# Altium schematic sheet Bandpass.SchDoc
size A; SheetNumber: 4; SheetTotal: 7
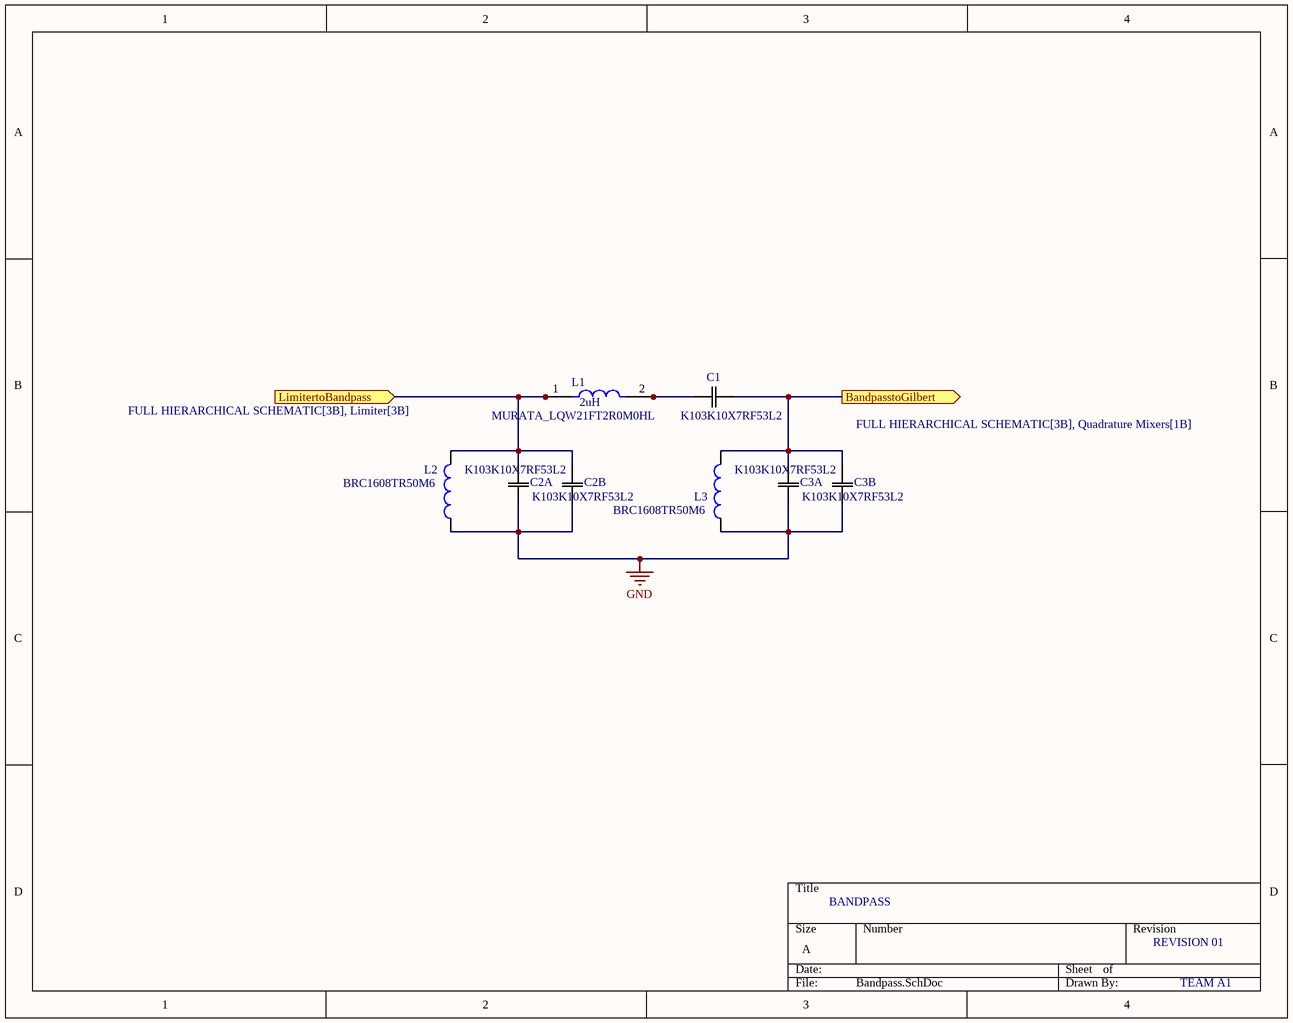
[diagram p0: Bandpass.SchDoc]

## Parts
C1  K103K10X7RF53L2  [K103K10X7RF53L2_VIS]
C2A  K103K10X7RF53L2  [K103K10X7RF53L2_VIS]
C2B  K103K10X7RF53L2  [K103K10X7RF53L2_VIS]
C3A  K103K10X7RF53L2  [K103K10X7RF53L2_VIS]
C3B  K103K10X7RF53L2  [K103K10X7RF53L2_VIS]
L1  MURATA_LQW21FT2R0M0HL  [MURATA_LQW21FT2R0M0HL_0]
L2  BRC1608TR50M6  [INDC1608X100N]
L3  BRC1608TR50M6  [INDC1608X100N]

## Ports
BandpasstoGilbert (out, see FULL HIERARCHICAL SCHEMATIC[3B], Quadrature Mixers[1B]), LimitertoBandpass (in, see FULL HIERARCHICAL SCHEMATIC[3B], Limiter[3B])

## Nets
GND: C2A.1 C2B.1 C3A.1 C3B.1 L2.1 L3.1
BandpasstoGilbert: C1.2 C3A.2 C3B.2 L3.2 ; port BandpasstoGilbert
LimitertoBandpass: C2A.2 C2B.2 L1.1 L2.2 ; port LimitertoBandpass
NetC1_1: C1.1 L1.2

## Notes on the sheet
- BANDPASS
- REVISION 01
- TEAM A1
- (in symbol MURATA_LQW21FT2R0M0HL) 2uH

## Library data of the parts
C1 C2A C2B C3A C3B = K103K10X7RF53L2: No Description Available; Mfr_Name: Vishay; Type: Ceramic Capacitor
L1 = MURATA_LQW21FT2R0M0HL: FIXED IND 2UH 450MA POWRTRN; MF: Murata Electronics; MP: LQW21FT2R0M0HL; Package: None; SnapEDA_Link: https://www.snapeda.com/parts/LQW21FT2R0M0HL/Murata/view-part/?ref=snap; Check_prices: https://www.snapeda.com/parts/LQW21FT2R0M0HL/Murata/view-part/?ref=eda; Value: *; Purchase-URL: https://pricing.snapeda.com/search/part/LQW21FT2R0M0HL/?ref=eda; Digi-Key_Part_Number: 490-LQW21FT2R0M0HLTR-ND
L2 L3 = BRC1608TR50M6: Inductor Power Chip Wirewound 500nH 20% 6MHz Ferrite 1.05A 117mOhm DCR 0603 T/R; Package: None; Price: None; Value: *; MP: BRC1608TR50M6; Availability: Unavailable